# EAGLE design RS232_v10 (EAGLE 6.2)
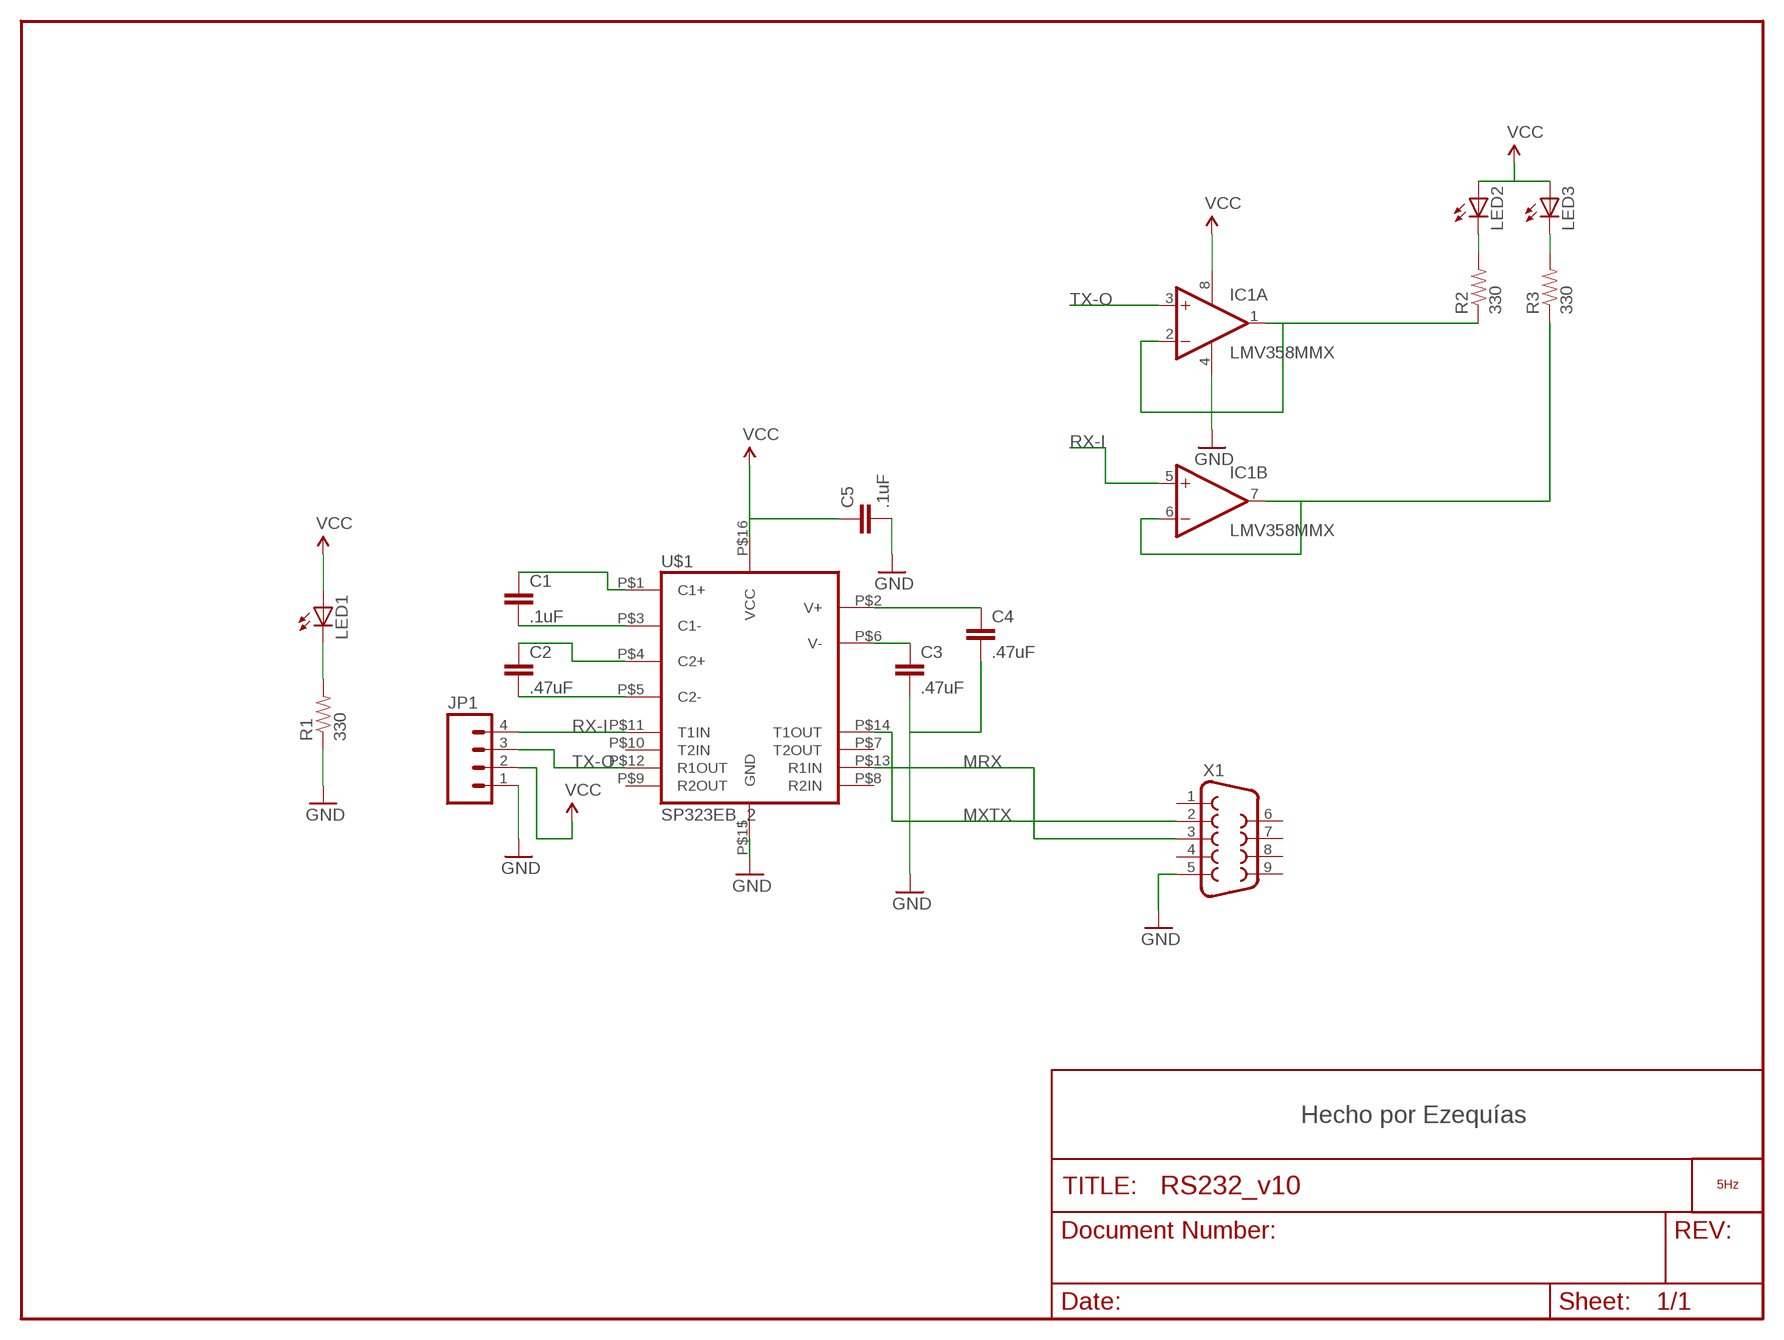
[diagram p0: schematic, sheet 1]

## Parts
C1  .1uF  CAP0603-CAP  [0603-CAP]
C2  .47uF  CAP0603-CAP  [0603-CAP]
C3  .47uF  CAP0603-CAP  [0603-CAP]
C4  .47uF  CAP0603-CAP  [0603-CAP]
C5  .1uF  CAP0603-CAP  [0603-CAP]
IC1  LMV358MMX  [MSOP08]
JP1  M04PTH  [1X04]
LED1  LED0603  [LED-0603]
LED2  LED0603  [LED-0603]
LED3  LED0603  [LED-0603]
LOGO1  LOGO_5HZ_MAIN_15MM  [5HZ_LOGO_MAIN_15MM]
R1  330  RESISTOR0603-RES  [0603-RES]
R2  330  RESISTOR0603-RES  [0603-RES]
R3  330  RESISTOR0603-RES  [0603-RES]
U$1  SP323EB_2  [SSOP-16]
X1  DB9FEMALE  [DB9]

## Nets
GND: C3.2 C4.2 C5.2 IC1.4(P:V-) JP1.1 R1.1 U$1.P$15(GND) X1.5
MRX: U$1.P$13(R1IN) X1.3
MXTX: U$1.P$14(T1OUT) X1.2
N$1: C1.1 U$1.P$1(C1+)
N$2: C1.2 U$1.P$3(C1-)
N$3: C2.1 U$1.P$4(C2+)
N$4: C2.2 U$1.P$5(C2-)
N$5: C3.1 U$1.P$6(V-)
N$6: C4.1 U$1.P$2(V+)
N$7: LED1.C R1.2
N$8: LED2.C R2.2
N$9: LED3.C R3.2
N$11: IC1.1(A:OUT) IC1.2(A:-IN) R2.1
N$13: IC1.6(B:-IN) IC1.7(B:OUT) R3.1
RX-I: IC1.5(B:+IN) JP1.4 U$1.P$11(T1IN)
TX-O: IC1.3(A:+IN) JP1.3 U$1.P$12(R1OUT)
VCC: C5.1 IC1.8(P:V+) JP1.2 LED1.A LED2.A LED3.A U$1.P$16(VCC)
Unconnected: U$1.P$7(T2OUT) U$1.P$8(R2IN) U$1.P$9(R2OUT) U$1.P$10(T2IN) X1.1 X1.4 X1.6 X1.7 X1.8 X1.9

## Notes on the sheet
- Hecho por Ezequías

## Library data of the parts
C1-C5 = SparkFun:CAP: Capacitor Standard 0603 ceramic capacitor, and 0.1" leaded capacitor.
IC1 = linear:LMV358?*: Dual General Purpose, Low Voltage, Rail-to-Rail Output Operational Amplifiers Source: http://www.national.com/mpf/LM/LMV321.html http://www.national.com/dt/lmv_qual.pdf
JP1 = SparkFun:M04: Header 4 Standard 4-pin 0.1" header. Use with straight break away headers (SKU : PRT-00116), right angle break away headers (PRT-00553), swiss pins (PRT-00743), machine pins (PRT-00117), and female headers (PRT-00115). Molex polarized connector foot print use with SKU : PRT-08231 with associated crimp pins and housings. 1MM SMD Version SKU: PRT-10208
LED1-LED3 = SparkFun:LED: LEDs Standard schematic elements and footprints for 5mm, 3mm, 1206, and 0603 sized LEDs. 5mm - Spark Fun Electronics SKU : COM-00529 (and others)
LOGO1 = 5hz-electronica:LOGO_5HZ: Logotipo 5Hz "según Pedro"
R1-R3 = SparkFun:RESISTOR: Resistor Basic schematic elements and footprints for 0603, 1206, and PTH resistors.
U$1 = SP3232EB:SP323EB_2
X1 = SparkFun:DB9: DB9 Connector Standard DB9 (D-Sub 9) serial connector. Can be used for CAN bus as well as RS485 and RS232. Footprint production proven. Spark Fun Electronics SKU : PRT-00429

## Board
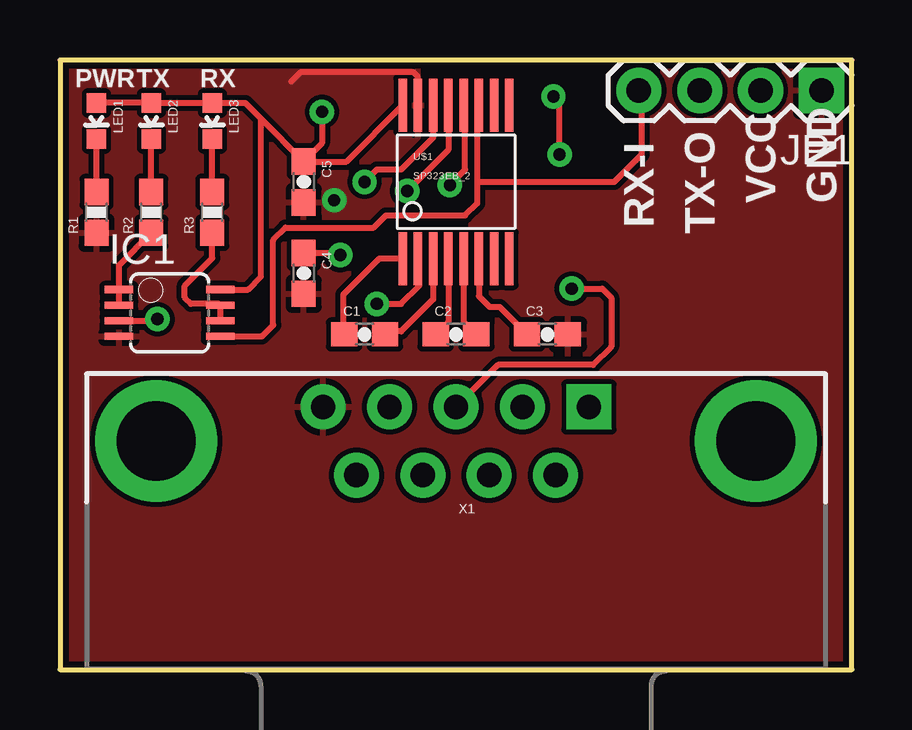
[diagram p1: board, top side]
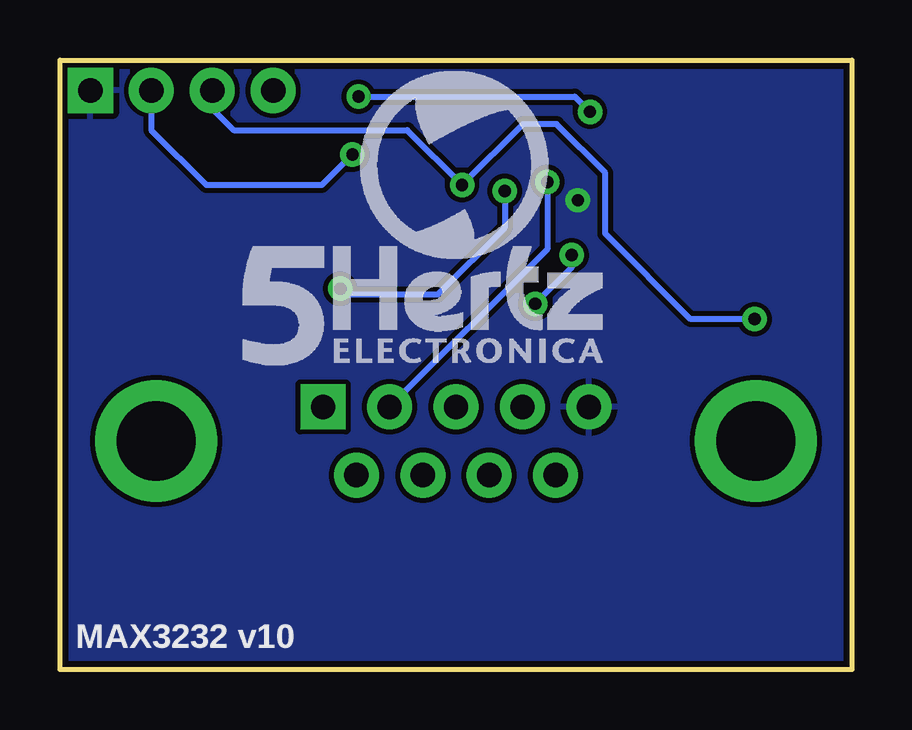
[diagram p2: board, bottom side, seen from below]

Size 33.02 x 25.4 mm. Coordinates in mm from the lower left corner, seen from the top.
Outline: 0,0 33.02,0 33.02,25.4 0,25.4 0,0
Copper layers (1*16): Top 0.035mm / dielectric 1.5mm / Bottom 0.035mm
Design rules: minimum track width 8mil, minimum drill 20mil, track to track 8mil, track to pad 8mil, pad to pad 8mil, via to via 8mil, smd to smd 8mil, copper to edge 10mil, drill to drill 8mil, minimum pad ring 12mil, minimum via ring 10mil, stop-mask expansion 4mil, vias tented up to drill 25mil, thermal gap 10mil

### Footprints (pad centres in the part's own frame; a part is rotated, then mirrored left to right if it is on the bottom)
0603-CAP = smd 1.1 x 1: 1 -0.85,0; 2 0.85,0
MSOP08 = smd 0.3 x 1.2: 1 -0.976,-2.113; 2 -0.326,-2.113; 3 0.324,-2.113; 4 0.974,-2.113; 5 0.974,2.112; 6 0.324,2.112; 7 -0.326,2.112; 8 -0.976,2.112
1X04 = drill 1.016 pad 1.88 square: 1 0,0 | drill 1.016 pad 1.88: 2 2.54,0; 3 5.08,0; 4 7.62,0
LED-0603 = smd 0.8 x 0.8: A 0,-0.75; C 0,0.75
0603-RES = smd 1.1 x 1: 1 -0.85,0; 2 0.85,0
SSOP-16 = smd 0.35 x 2.2: P$1 -2.223,-3.2; P$2 -1.587,-3.2; P$3 -0.953,-3.2; P$4 -0.318,-3.2; P$5 0.318,-3.2; P$6 0.953,-3.2; P$7 1.587,-3.2; P$8 2.223,-3.2; P$9 2.223,3.2; P$10 1.587,3.2; P$11 0.953,3.2; P$12 0.318,3.2; P$13 -0.318,3.2; P$14 -0.953,3.2; P$15 -1.587,3.2; P$16 -2.223,3.2
DB9 = drill 1.016 pad 1.88 square: 1 -5.54,-1.42 | drill 1.016 pad 1.88: 2 -2.77,-1.42; 3 0,-1.42; 4 2.77,-1.42; 5 5.54,-1.42; 6 -4.15,1.42; 7 -1.38,1.42; 8 1.38,1.42; 9 4.15,1.42 | drill 3.302 pad 5.08: G1 -12.5,0; G2 12.5,0

### Placement (x,y rotation side)
C1  12.7,13.97 0 top
C2  16.51,13.97 0 top
C3  20.32,13.97 0 top
C4  10.16,16.51 270 top
C5  10.16,20.32 270 top
IC1  4.57,14.86 270 top
JP1  31.75,24.13 180 top
LED1  1.52,22.86 180 top
LED2  3.81,22.86 180 top
LED3  6.35,22.86 180 top
LOGO1  25.4,12.7 0 bottom
R1  1.52,19.05 90 top
R2  3.81,19.05 90 top
R3  6.35,19.05 90 top
U$1  16.51,20.32 0 top
X1  16.51,9.53 180 top

### Tracks (layer width: path | path; a pad name or v marks a point on that pad's centre or on a via)
GND  (via drill 0.51)
  Top 0.254: U$1.P$15 14.92,24.7 14.73,24.89 10.03,24.89 9.65,24.51
  other vias: 11.43,19.56
  pour Top: 0,25.4 33.02,25.4 33.02,0 0,0
  pour Bottom: 0,25.4 33.02,25.4 33.02,0 0,0
MRX  (via drill 0.51)
  Top 0.254: U$1.P$13 16.19,21.65 v14.48,19.94 | v21.34,15.88 22.61,15.88 22.99,15.49 22.99,13.46 22.23,12.7 18.27,12.7 X1.3
  Bottom 0.254: v14.48,19.94 14.48,18.41 17.27,15.62 21.08,15.62 v21.34,15.88
MXTX  (via drill 0.51)
  Top 0.254: U$1.P$14 15.56,22.16 14.22,20.83 13.21,20.83 v12.7,20.32
  Bottom 0.254: v12.7,20.32 12.7,17.52 X1.2
N$1
  Top 0.254: 12.06,14.19 C1.1 11.81,14.01 11.81,15.62 13.31,17.12 U$1.P$1
N$2
  Top 0.254: U$1.P$3 15.56,15.43 14.22,14.1 13.68,14.1 C1.2
N$3
  Top 0.254: 15.88,14.19 C2.1 16.19,14.5 U$1.P$4
N$4
  Top 0.254: 17.14,14.19 C2.2 16.83,14.5 U$1.P$5
N$5
  Top 0.254: U$1.P$6 17.46,15.56 17.91,15.11 18.33,15.11 C3.1
N$6  (via drill 0.51)
  Top 0.254: C4.1 11.6,17.36 v11.68,17.27 | v13.21,15.24 14.22,15.24 14.99,16 14.99,17.06 U$1.P$2
  Bottom 0.254: v11.68,17.27 11.68,16.76 v13.21,15.24
N$7
  Top 0.254: R1.2 LED1.C
N$8
  Top 0.254: R2.2 LED2.C
N$9
  Top 0.254: R3.2 LED3.C
N$11
  Top 0.254: IC1.2 IC1.1 2.46,16.85 R2.1
N$13
  Top 0.254: R3.1 6.35,17.14 5.21,16 5.21,15.49 5.46,15.24 6.63,15.24 IC1.7 IC1.6
RX-I
  Top 0.254: IC1.5 8.42,13.88 8.89,14.35 8.89,17.91 9.4,18.41 13.08,18.41 13.59,18.92 16.89,18.92 17.4,19.43 17.4,20.32 | 17.4,20.32 17.4,23.46 U$1.P$11 | 23.88,24.13 JP1.4 24.26,24 24.26,21.46 23.11,20.32 17.4,20.32
TX-O  (via drill 0.51)
  Top 0.254: IC1.3 3.99,14.54 v4.06,14.61 | v16.26,20.19 16.89,20.83 16.89,23.46 U$1.P$12
  Bottom 0.254: JP1.3 26.67,23.37 25.78,22.48 18.54,22.48 v16.26,20.19 13.72,22.73 12.32,22.73 10.29,20.7 10.29,18.16 6.73,14.61 v4.06,14.61
VCC  (via drill 0.51)
  Top 0.254: LED1.A LED2.A LED3.A 7.72,23.61 8.38,22.95 | 8.38,22.95 C5.1 | C5.1 11.94,21.17 U$1.P$16 | IC1.8 7.83,15.84 8.38,16.38 8.38,22.95 | v20.83,21.46 20.83,23.62 v20.57,23.88 | v10.92,23.24 10.92,21.93 C5.1
  Bottom 0.254: JP1.2 29.21,22.48 26.92,20.19 22.1,20.19 v20.83,21.46 | v20.57,23.88 11.56,23.88 v10.92,23.24

### Text on the board
tPlace: PWR | TX | RX | VCC | GND | RX-I | TX-O
bPlace: MAX3232 v10